# Altium schematic sheet HV Sense.SchDoc
size A4; SheetNumber: 7; SheetTotal: 11
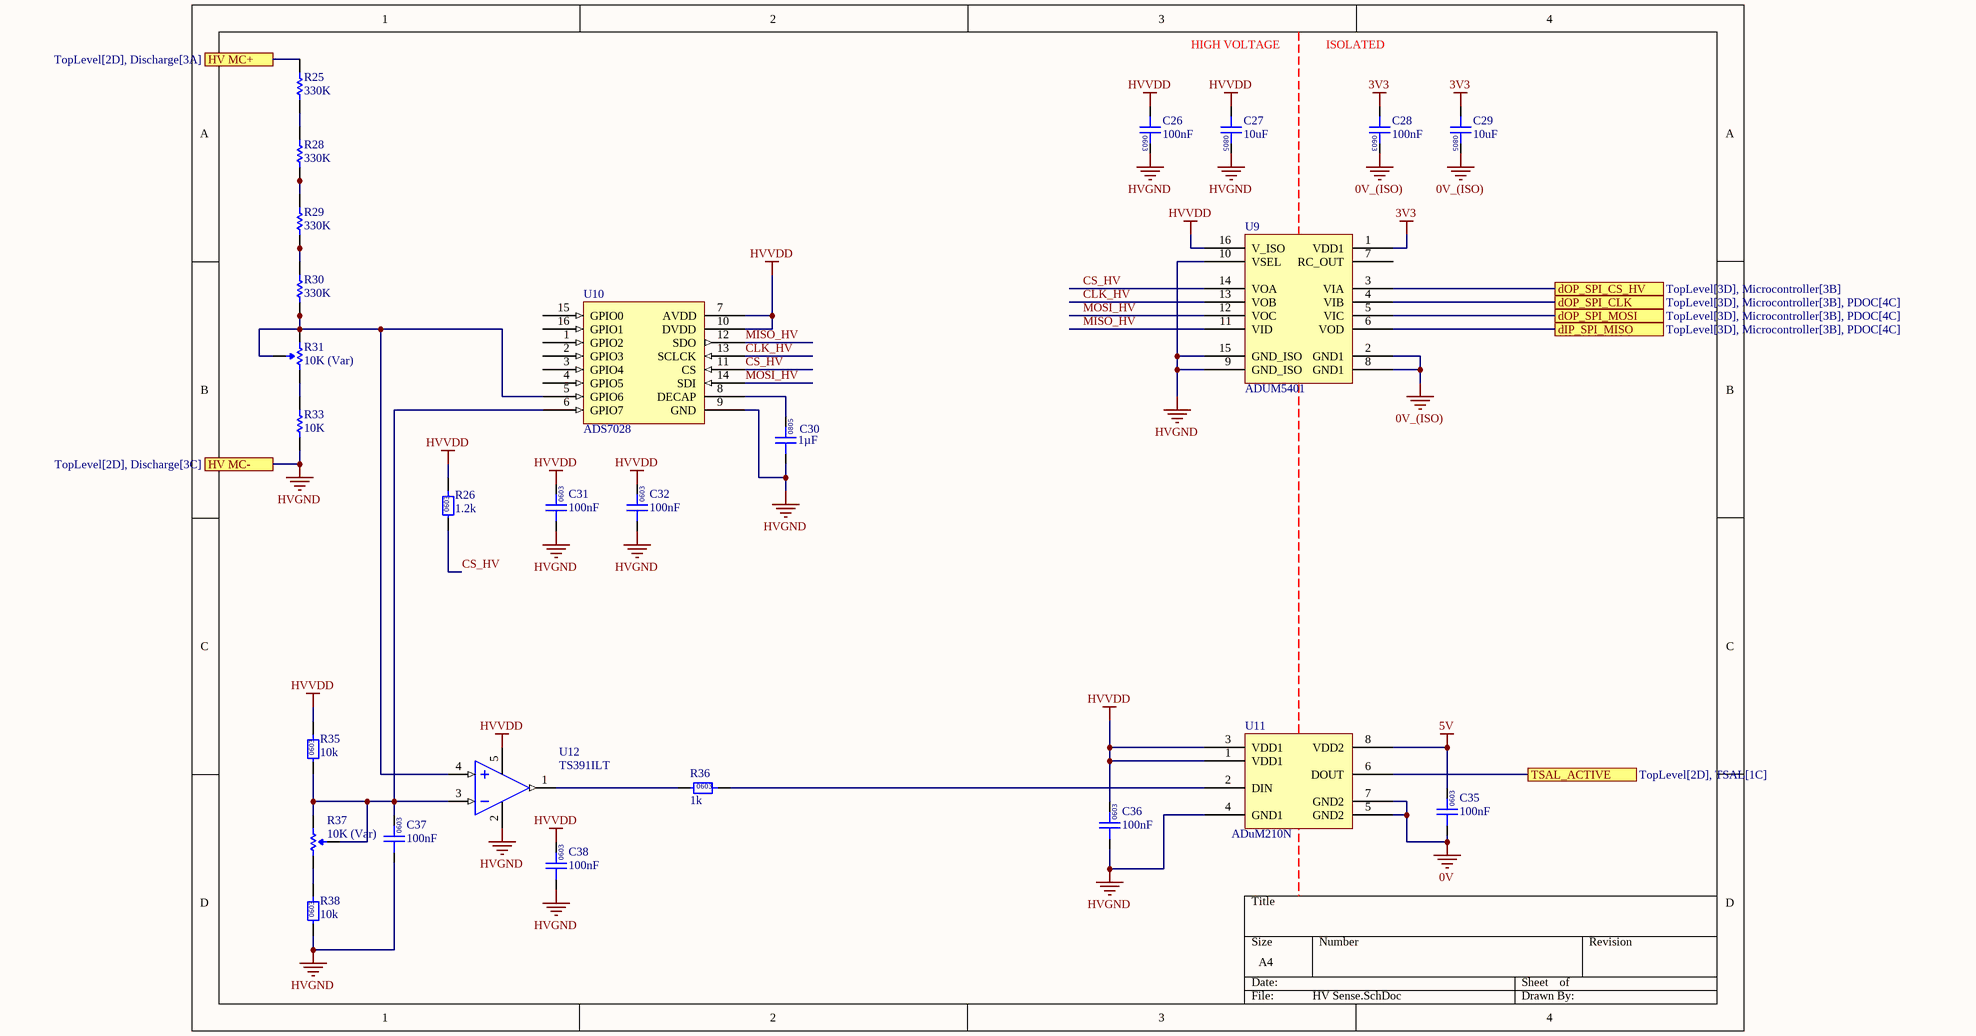
[diagram p0: HV Sense.SchDoc]

## Parts
C26  100nF  [0603]
C27  10uF  [0805]
C28  100nF  [0603]
C29  10uF  [0805]
C30  1µF  [0805]
C31  100nF  [0603]
C32  100nF  [0603]
C35  100nF  [0603]
C36  100nF  [0603]
C37  100nF  [0603]
C38  100nF  [0603]
R25  330K  [VB 0207]
R26  1.2k  [0603]
R28  330K  [VB 0207]
R29  330K  [VB 0207]
R30  330K  [VB 0207]
R31  10K (Var)  [B 3296]
R33  10K  [VB 0207]
R35  10k  [0603]
R36  1k  [0603]
R37  10K (Var)  [B 3296]
R38  10k  [0603]
U9  ADUM5401  [AD 16-SOIC]
U10  ADS7028  [WFQN-16]
U11  ADuM210N  [SOIC-8W]
U12  TS391ILT  [ON SOT-23-5]

## Ports
dIP_SPI_MISO (see TopLevel[3D], Microcontroller[3B], PDOC[4C]), dOP_SPI_CLK (see TopLevel[3D], Microcontroller[3B], PDOC[4C]), dOP_SPI_CS_HV (see TopLevel[3D], Microcontroller[3B]), dOP_SPI_MOSI (see TopLevel[3D], Microcontroller[3B], PDOC[4C]), HV MC+ (see TopLevel[2D], Discharge[3A]), HV MC- (see TopLevel[2D], Discharge[3C]), TSAL_ACTIVE (see TopLevel[2D], TSAL[1C])

## Nets
0V: C35.1 U11.5(GND2) U11.7(GND2)
0V_(ISO): C28.2 C29.2 U9.2(GND1) U9.8(GND1)
3V3: C28.1 C29.1 U9.1(VDD1)
5V: C35.2 U11.8(VDD2)
HVGND: C26.2 C27.2 C30.1 C31.1 C32.1 C36.1 C37.1 C38.1 R33.1 R38.1 U9.9(GND_ISO) U9.10(VSEL) U9.15(GND_ISO) U10.9(GND) U11.4(GND1) U12.2(VCC-) ; port HV MC-
HVVDD: C26.1 C27.1 C31.2 C32.2 C36.2 C38.2 R26.2 R35.2 U9.16(V_ISO) U10.7(AVDD) U10.10(DVDD) U11.1(VDD1) U11.3(VDD1) U12.5(VCC+)
CLK_HV: U9.13(VOB) U10.13(SCLCK)
CS_HV: R26.1 U9.14(VOA) U10.11(CS)
dIP_SPI_MISO: U9.6(VOD) ; port dIP_SPI_MISO
dOP_SPI_CLK: U9.4(VIB) ; port dOP_SPI_CLK
dOP_SPI_CS_HV: U9.3(VIA) ; port dOP_SPI_CS_HV
dOP_SPI_MOSI: U9.5(VIC) ; port dOP_SPI_MOSI
HV MC+: R25.2 ; port HV MC+
MISO_HV: U9.11(VID) U10.12(SDO)
MOSI_HV: U9.12(VOC) U10.14(SDI)
TSAL_ACTIVE: U11.6(DOUT) ; port TSAL_ACTIVE
NetC30_2: C30.2 U10.8(DECAP)
NetC37_2: C37.2 R35.1 R37.1(CCW) R37.2(Wiper) U10.6(GPIO7) U12.3(IN-)
NetR25_1: R25.1 R28.2
NetR28_1: R28.1 R29.2
NetR29_1: R29.1 R30.2
NetR30_1: R30.1 R31.2(Wiper) R31.3(CW) U10.5(GPIO6) U12.4(IIN+)
NetR31_1: R31.1(CCW) R33.2
NetR36_1: R36.1 U12.1(OUT)
NetR36_2: R36.2 U11.2(DIN)
NetR37_3: R37.3(CW) R38.2

Not connected (* = marked no-connect by the designer): U9 7(RC_OUT); U10 1(GPIO2) 2(GPIO3) 3(GPIO4) 4(GPIO5) 15(GPIO0) 16(GPIO1)

## Notes on the sheet
- HIGH VOLTAGE
- ISOLATED
- (in symbol GCM21BR71H105KA03L) 0805
- (in symbol GCM188L81H104KA57D) 0603
- (in symbol GRM21BR6YA106KE43L) 0805
- (in symbol RC0603FR-071KL) 0603
- (in symbol RC0603FR-0710KL) 0603
- (in symbol RC0603JR-071K2L) 0603

## Library data of the parts
C26 C28 C31 C32 C35-C38 = GCM188L81H104KA57D: Manufacturer: muRata; Rated Voltage: 50V; Tolerance: ±10%; Material: MLCC; Temperature Rating: X8L; Part Number: GCM188L81H104KA57D; Value: 100nF; Digikey Part Number: 490-6049-1-ND
C27 C29 = GRM21BR6YA106KE43L: Manufacturer: muRata; Rated Voltage: 50V; Tolerance: 10%; Material: MLCC; Temperature Rating: X5R; Part Number: GRM21BR6YA106KE43L; Value: 10uF; Digikey Part Number: 490-10514-6-ND
C30 = GCM21BR71H105KA03L: Manufacturer: muRata; Rated Voltage: 50V; Tolerance: ±10%; Material: MLCC; Temperature Rating: X7R; Part Number: GCM21BR71H105KA03L; Value: 1µF; Digikey Part Number: 490-10675-1-ND
R25 R28-R30 = MMB02070C3303FB200: Manufacturer: Vishay Beyschlag; Tolerance: 0.01; Rated Power: 1W; Part Number: MMB02070C3303FB200; Value: 330K; Digikey Part Number: MMB-330KBCT-ND
R26 = RC0603JR-071K2L: Manufacturer: YAGEO; Tolerance: 0.01; Rated Power: 0.1W; Part Number: RC0603JR-071K2L; Value: 1.2k; Material: FR-07; Digikey Part Number: 311-1.2KGRCT-ND
R31 R37 = 3296W-1-103LF: Manufacturer: Bournes Inc; Tolerance: 0.1; Rated Power: 0.5W; Part Number: 3296W-1-103LF; Value: 10K (Var); Digikey Part Number: 3296W-103LF-ND
R33 = MMB02070C1003FB200: Manufacturer: Vishay Beyschlag; Tolerance: 0.01; Rated Power: 1W; Part Number: MMB02070C1003FB200; Value: 10K; Digikey Part Number: MMB-10KBCT-ND
R35 R38 = RC0603FR-0710KL: Manufacturer: YAGEO; Tolerance: 0.01; Rated Power: 0.1W; Part Number: RC0603FR-0710KL; Value: 10k; Digikey Part Number: 311-10.0KHRCT-ND; Material: FR-07
R36 = RC0603FR-071KL: Manufacturer: YAGEO; Tolerance: 0.01; Rated Power: 0.1W; Part Number: RC0603FR-071KL; Value: 1k; Digikey Part Number: 311-1.00KHRCT-ND; Material: FR-07
U9 = ADUM5401: Quad Channel 2.5kV Digital Isolator with isoPower; Manufacturer: Analogue Devices; Part Number: ADUM5401
U10 = ADS7028IRTER: IC ADC 12BIT SAR 16WQFN; Manufacturer: Texas Instruments; Part Number: ADS7028IRTER; Digikey Part Number: ADS7028IRTER; Digikey Link: https://www.digikey.com.au/en/products/detail/texas-instruments/ADS7028IRTER/12696020?s=N4IgTCBcDaIIIBEDKB2ADGAHASQEoBUBRXEAXQF8g
U11 = CMP-110-000007-1: DIGITAL ISOLATOR, SINGLE CHANNEL; Digikey Link: #https://www.analog.com/media/en/technical-documentation/data-sheets/ADuM210N.pdf#; Part Number: ADuM210N
U12 = CMP-022-000013-1: IC COMP LO PWR SGL V SOT 23-5L; Part Number: TS391ILT